# EAGLE schematic nRF24L01-Chip-v13 (EAGLE 7.7.0)
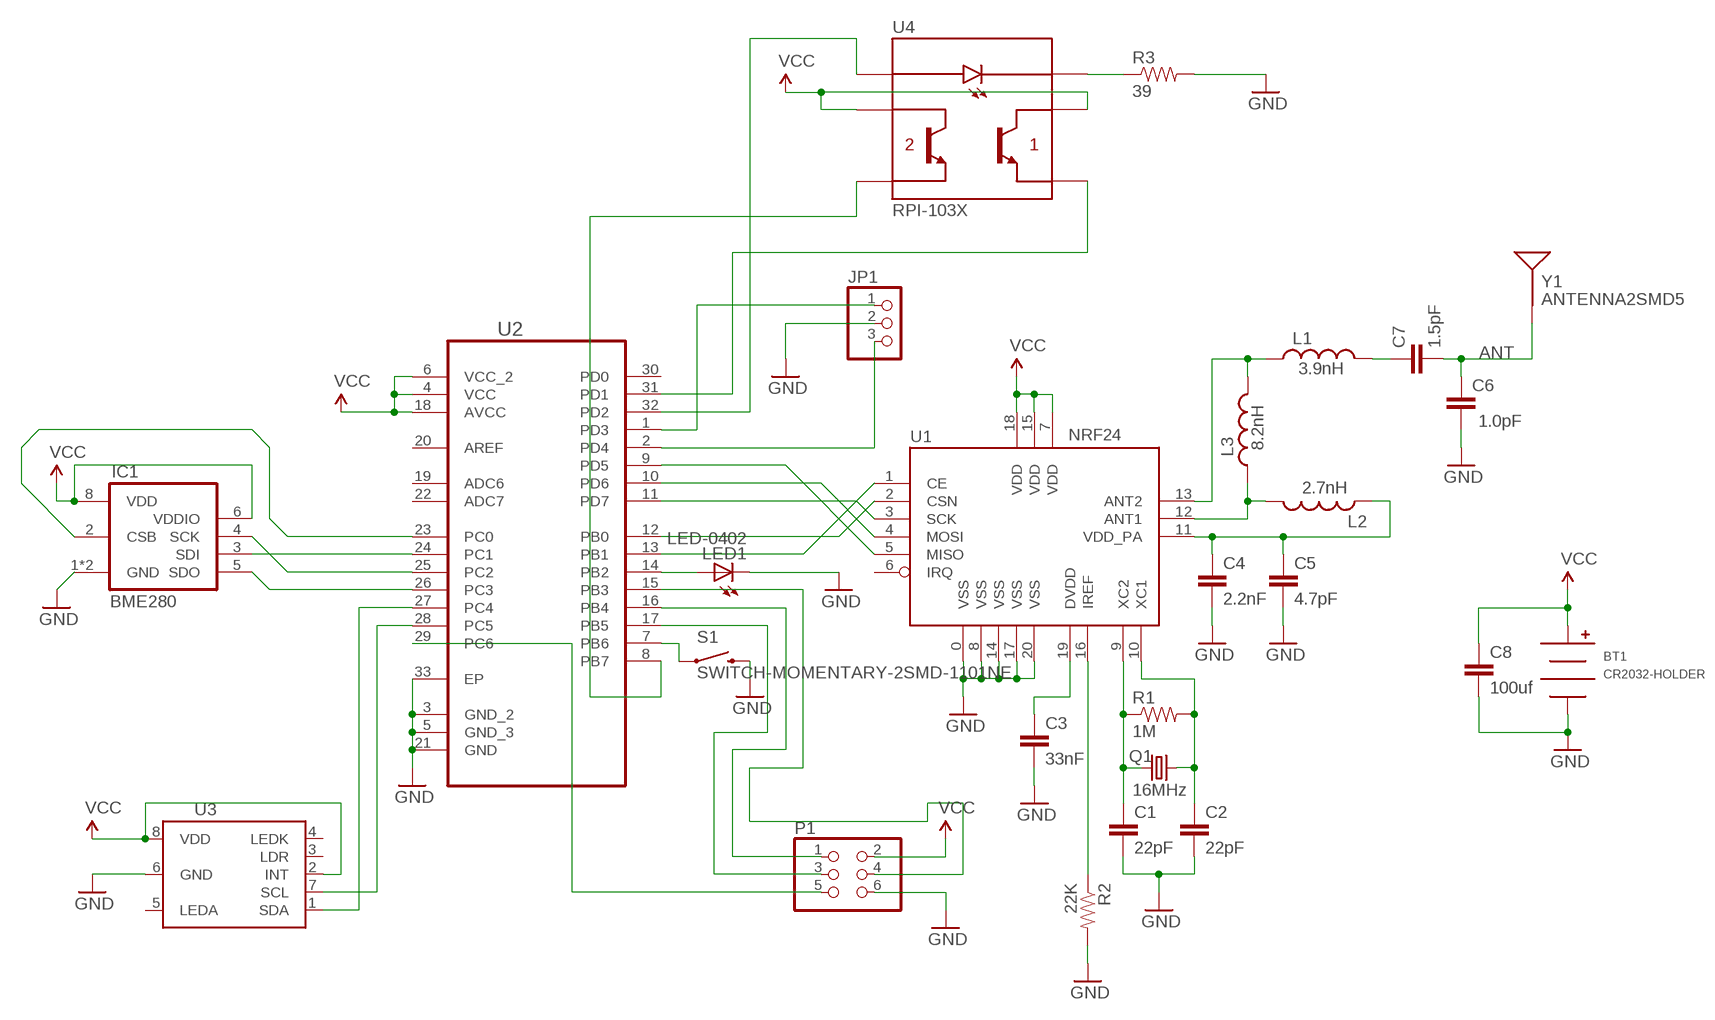
[diagram p0: schematic, sheet 1]

## Parts
BT1  CR2032-HOLDER  [CH28-2032LF]
C1  22pF  CAP0402-CAP  [0402-CAP]
C2  22pF  CAP0402-CAP  [0402-CAP]
C3  33nF  CAP0402-CAP  [0402-CAP]
C4  2.2nF  CAP0402-CAP  [0402-CAP]
C5  4.7pF  CAP0402-CAP  [0402-CAP]
C6  1.0pF  CAP0402-CAP  [0402-CAP]
C7  1.5pF  CAP0402-CAP  [0402-CAP]
C8  100uf  CAP1206  [1206]
IC1  BME280  [BME280]
JP1  PINHD-1X31X03_SMT  [1X03_SMT]
L1  3.9nH  INDUCTOR0402  [C0402]
L2  2.7nH  INDUCTOR0402  [C0402]
L3  8.2nH  INDUCTOR0402  [C0402]
LED1  LED-0402  [0402-LED]
P1  PINHD-2X3SMT  [2X03_SMT]
Q1  16MHz  CRYSTAL5X3  [CRYSTAL-SMD-5X3]
R1  1M  RESISTOR0402-RES  [0402-RES]
R2  22K  RESISTOR0402-RES  [0402-RES]
R3  39  RESISTOR0402-RES  [0402-RES]
S1  SWITCH-MOMENTARY-2SMD-1101NE  [TACTILE-SWITCH-1101NE]
U1  NRF24  NRF24L01ALT1  [QFN20_ALT1]
U2  ATMEGA328P-MU  [QFN50P500X500X100-33N]
U3  APDS-9960  [APDS-9960]
U4  RPI-103X  [RPI-103X]
Y1  ANTENNA2SMD5  [ANTENNA-CHIP5]

## Nets
ANT: C6.2 C7.2 Y1.FEED(SIGNAL)
GND: BT1.NEG C1.2 C2.2 C3.2 C4.2 C5.2 C6.1 C8.2 IC1.1(GND) IC1.7(GND) JP1.2 LED1.C P1.6 R2.2 R3.2 S1.2 U1.0(VSS) U1.8(VSS) U1.14(VSS) U1.17(VSS) U1.20(VSS) U2.3(GND_2) U2.5(GND_3) U2.21(GND) U2.33(EP) U3.6(GND)
N$1: C1.1 Q1.1 R1.1 U1.9(XC2)
N$2: C2.1 Q1.3 R1.2 U1.10(XC1)
N$3: L2.2 L3.1 U1.12(ANT1)
N$4: R2.1 U1.16(IREF)
N$5: C3.1 U1.19(DVDD)
N$6: L1.1 L3.2 U1.13(ANT2)
N$7: C4.1 C5.1 L2.1 U1.11(VDD_PA)
N$8: IC1.5(SDO) U2.26(PC3)
N$9: C7.1 L1.2
N$11: P1.3 U2.17(PB5)
N$12: P1.4 U2.15(PB3)
N$13: P1.1 U2.16(PB4)
N$14: P1.5 U2.29(PC6)
N$15: U2.27(PC4) U3.1(SDA)
N$16: U2.28(PC5) U3.7(SCL)
N$17: IC1.4(SCK) U2.25(PC2)
N$18: U1.5(MISO) U2.9(PD5)
N$19: U1.4(MOSI) U2.10(PD6)
N$20: IC1.3(SDI) U2.24(PC1)
N$21: U1.3(SCK) U2.11(PD7)
N$22: U1.2(CSN) U2.12(PB0)
N$23: IC1.2(CSB) U2.23(PC0)
N$24: JP1.3 U2.2(PD4)
N$25: JP1.1 U2.1(PD3)
N$26: LED1.A U2.14(PB2)
N$28: S1.1 U2.7(PB6)
N$29: U2.32(PD2) U4.6(ANODE)
N$30: U2.31(PD1) U4.1(E1)
N$31: U2.8(PB7) U4.4(E2)
N$32: R3.1 U4.3(CATHODE)
N$37: U1.1(CE) U2.13(PB1)
VCC: BT1.POS C8.1 IC1.6(VDDIO) IC1.8(VDD) P1.2 U1.7(VDD) U1.15(VDD) U1.18(VDD) U2.4(VCC) U2.6(VCC_2) U2.18(AVCC) U3.2(INT) U3.8(VDD) U4.2(C1) U4.5(C2)
Unconnected: U1.6(IRQ) U2.19(ADC6) U2.20(AREF) U2.22(ADC7) U2.30(PD0) U3.3(LDR) U3.4(LEDK) U3.5(LEDA)

## Library data of the parts
BT1 = battery-holder:CR2032-HOLDER
C1-C7 = SparkFun:CAP: Capacitor Standard 0603 ceramic capacitor, and 0.1" leaded capacitor.
C8 = SparkFun-Capacitors:CAP: Capacitor Standard 0603 ceramic capacitor, and 0.1" leaded capacitor.
IC1 = bosch-bme280:BME280: DIGITAL HUMIDITY, PRESSURE AND TEMPERATURE SENSOR * Digital interface I²C (up to 3.4 MHz) and SPI (3 and 4 wire, up to 10 MHz)* Supply voltage VDD main supply voltage range: 1.71 V to 3.6 V*VDDIO interface voltage range: 1.2 V to 3.6 V Operating range -40…+85 °C, 0…100 % rel. humidity, 300…1100 hPa The library has been designed by Richard Magdycz <https://www.facebook.com/groups/eaglecadsoftUK>
JP1 = pinhead+:PINHD-1X3: PIN HEADER
L1-L3 = SparkFun:INDUCTOR: Inductors Basic Inductor/Choke - 0603 and 1206. Footprints are not proven and vary greatly between part numbers.
LED1 = pel_dipol_comp:LED
P1 = pinhead+:PINHD-2X3: PIN HEADER
Q1 = SparkFun:CRYSTAL: Crystals Various standard crystals. Proven footprints. Spark Fun Electronics SKU : COM-00534
R1-R3 = SparkFun:RESISTOR: Resistor Basic schematic elements and footprints for 0603, 1206, and PTH resistors.
S1 = SparkFun-Electromechanical:SWITCH-MOMENTARY-2: Various NO switches- pushbuttons, reed, etc; PROD_ID: SWCH-00815
U1 = Testing:NRF24L01: 2.4GHz Low Power Transceiver This is the very popular, low cost, very low power RF transceiver from Nordic Semiconductor. Simple SPI interface. SKU: COM-00690
U2 = Ava:ATMEGA328P-MU: Programmable Flash; MPN: ATMEGA328P-MU; OC_FARNELL: 1748522; OC_NEWARK: 26R2526; PACKAGE: QFN-32; SUPPLIER: Atmel
U3 = SparkFun-Sensors:APDS-9960: Avago APDS-9960 digital proximity, ambient light, RGB, and gesture sensor.; PROD_ID: SEN-12005
U4 = SparkFun-Sensors:RPI-103X; PROD_ID: 10414
Y1 = SparkFun:ANTENNA2: Antenna Single endded antenna. Common with smaller chip antennas. CHIP4 package is the GPS Chip Antenna SKU: GPS-08418. CHIP5 package is 2.4GHz chip antenna SKU: WRL-00144.